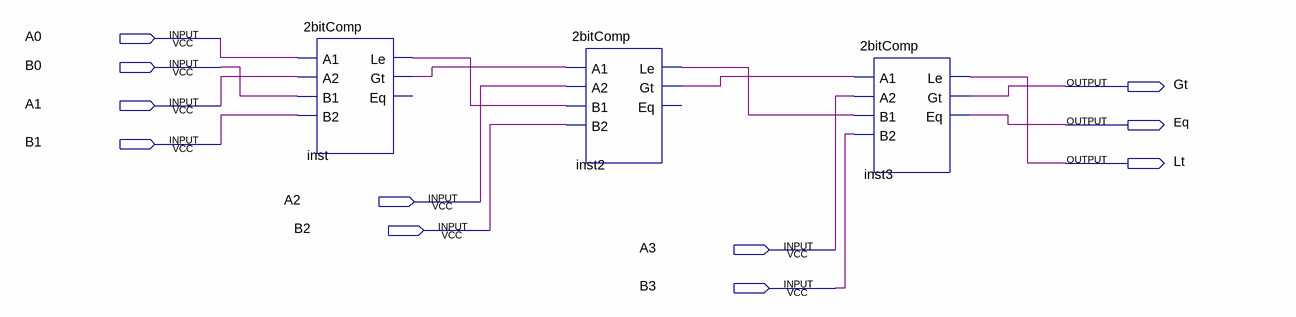
[diagram p0: schematic sheet]
// Quartus schematic practice3.bdf as structural Verilog: 3 symbols, 11 pins
module practice3 (
  input  A0,
  input  B0,
  input  A1,
  input  B1,
  input  A2,
  input  B2,
  input  A3,
  input  B3,
  output Gt,
  output Eq,
  output Lt
);

  wire inst2_gt, inst2_le, inst_gt, inst_le;

  \2bitComp  inst (.A1(A0), .A2(A1), .B1(B0), .B2(B1), .Le(inst_le), .Gt(inst_gt));  // open: Eq
  \2bitComp  inst2 (.A1(inst_gt), .A2(A2), .B1(inst_le), .B2(B2), .Le(inst2_le), .Gt(inst2_gt));  // open: Eq
  \2bitComp  inst3 (.A1(inst2_gt), .A2(A3), .B1(inst2_le), .B2(B3), .Le(Lt), .Gt(Gt), .Eq(Eq));
endmodule
